# Altium schematic sheet power_cpu.SchDoc
size A3
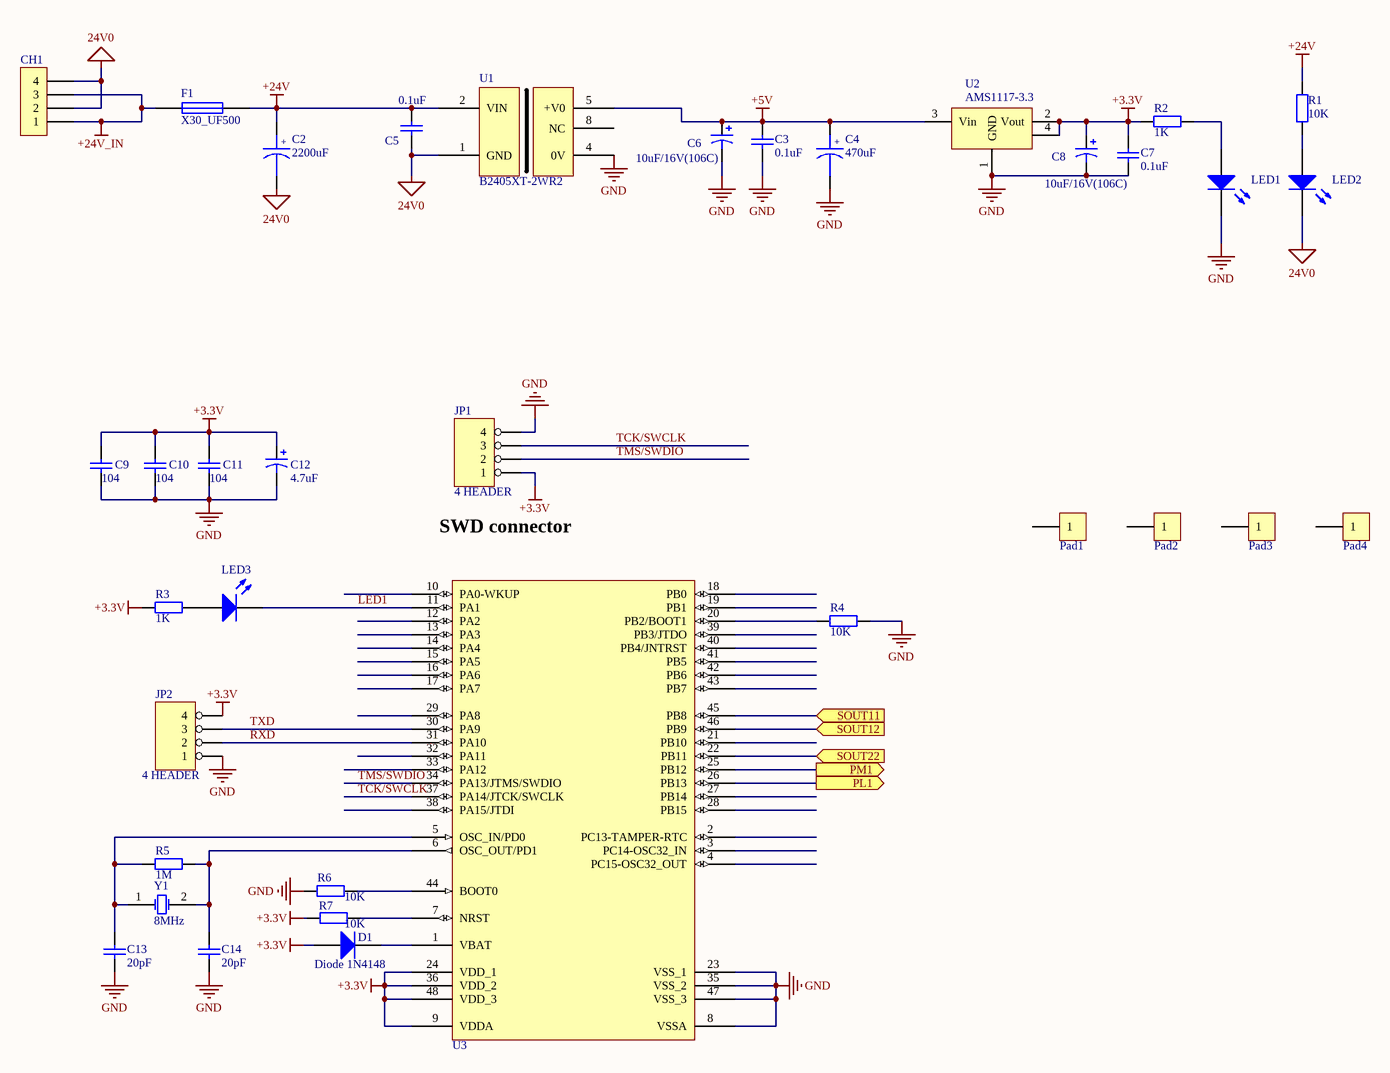
[diagram p0: power_cpu.SchDoc]

## Parts
C2  C_2200uF  [C7.8*17]  (value not drawn)
C3  value 0.1uF  [0805]  (hidden comment: Cap)
C4  C_2200uF  [C5*10]  (value not drawn)
C5  value 0.1uF  [0805]  (hidden comment: Cap)
C6  value 10uF/16V(106C)  [CAP A-3216]  (hidden comment: Cap Pol3)
C7  value 0.1uF  [0805]  (hidden comment: Cap)
C8  value 10uF/16V(106C)  [CAP A-3216]  (hidden comment: Cap Pol3)
C9  value 104  [0805]  (hidden comment: Cap)
C10  value 104  [0805]  (hidden comment: Cap)
C11  value 104  [0805]  (hidden comment: Cap)
C12  value 4.7uF  [3225[1210]]  (hidden comment: Cap Pol1)
C13  value 20pF  [0805]  (hidden comment: Cap)
C14  value 20pF  [0805]  (hidden comment: Cap)
CH1  HEADER1X4  [CH3.96-4PIN]  (value not drawn)
D1  Diode 1N4148  [LL34]
F1  X30_UF500  [X30UF600]
JP1  4 HEADER  [CON4_1.5]
JP2  4 HEADER  [HDR1X4]
LED1  (no value)  [LED-0805]
LED2  (no value)  [LED-0805]
LED3  (no value)  [LED-0805]
Pad1  Pad  [pad35]  (value not drawn)
Pad2  Pad  [pad35]  (value not drawn)
Pad3  Pad  [pad35]  (value not drawn)
Pad4  Pad  [pad35]  (value not drawn)
R1  value 10K  [0805]  (hidden comment: Res2)
R2  value 1K  [0805]  (hidden comment: Res2)
R3  value 1K  [0805]  (hidden comment: Res2)
R4  value 10K  [0805]  (hidden comment: Res2)
R5  value 1M  [0805]  (hidden comment: Res2)
R6  value 10K  [0805]  (hidden comment: Res2)
R7  value 10K  [0805]  (hidden comment: Res2)
U1  B2405XT-2WR2  [B2405XT-2WR2]
U2  AMS1117-3.3  [SOT223]
U3  STM32F103C8T6  [LQFP48]  (value not drawn)
Y1  8MHz  [XTAL_US]

## Ports
PL1 (out), PM1 (out), SOUT11 (in), SOUT12 (in), SOUT22 (in)

## Nets
24V0: C2.2 C5.1 CH1.2 CH1.4 LED2.2(K) U1.1(GND)
+3.3V: C7.2 C8.1 C9.2 C10.2 C11.2 C12.1 D1.1(A) JP1.1 JP2.4 R2.2 R3.2 R7.1 U2.2(Vout) U2.4 U3.9(VDDA) U3.24(VDD_1) U3.36(VDD_2) U3.48(VDD_3)
+5V: C3.2 C4.1 C6.1 U1.5(+V0) U2.3(Vin)
+24V: C2.1 C5.2 F1.2 R1.2 U1.2(VIN)
+24V_IN: CH1.1 CH1.3 F1.1
GND: C3.1 C4.2 C6.2 C7.1 C8.2 C9.1 C10.1 C11.1 C12.2 C13.1 C14.1 JP1.4 JP2.1 LED1.2(K) R4.2 R6.1 U1.4(0V) U2.1(GND) U3.8(VSSA) U3.23(VSS_1) U3.35(VSS_2) U3.47(VSS_3)
LED1: LED3.2(K) U3.11(PA1)
PL1: U3.26(PB13) ; port PL1
PM1: U3.25(PB12) ; port PM1
RXD: JP2.2 U3.31(PA10)
SOUT11: U3.45(PB8) ; port SOUT11
SOUT12: U3.46(PB9) ; port SOUT12
SOUT22: U3.22(PB11) ; port SOUT22
TCK/SWCLK: JP1.3 U3.37(PA14/JTCK/SWCLK)
TMS/SWDIO: JP1.2 U3.34(PA13/JTMS/SWDIO)
TXD: JP2.3 U3.30(PA9)
NetC13_2: C13.2 R5.1 U3.5(OSC_IN/PD0) Y1.1(OSC1)
NetC14_2: C14.2 R5.2 U3.6(OSC_OUT/PD1) Y1.2(OSC2)
NetD1_2: D1.2(K) U3.1(VBAT)
NetLED1_1: LED1.1(A) R2.1
NetLED2_1: LED2.1(A) R1.1
NetLED3_1: LED3.1(A) R3.1
NetR4_1: R4.1 U3.20(PB2/BOOT1)
NetR6_2: R6.2 U3.44(BOOT0)
NetR7_2: R7.2 U3.7(NRST)

Not connected (* = marked no-connect by the designer): Pad1 1; Pad2 1; Pad3 1; Pad4 1; U1 8(NC); U3 2(PC13-TAMPER-RTC) 3(PC14-OSC32_IN) 4(PC15-OSC32_OUT) 10(PA0-WKUP) 12(PA2) 13(PA3) 14(PA4) 15(PA5) 16(PA6) 17(PA7) 18(PB0) 19(PB1) 21(PB10) 27(PB14) 28(PB15) 29(PA8) 32(PA11) 33(PA12) 38(PA15/JTDI) 39(PB3/JTDO) 40(PB4/JNTRST) 41(PB5) 42(PB6) 43(PB7)

## Notes on the sheet
- SWD connector
- (in symbol C_2200uF) +; 2200uF; 470uF

## Library data of the parts
C3 C5 C7 C9-C11 C13 C14 = Cap: Capacitor; Published: 8-Jun-2000; LatestRevisionDate: 17-Jul-2002; LatestRevisionNote: Re-released for DXP Platform.; Publisher: Altium Limited
  C3 C5 C7 C9-C11: PackageReference: RAD-0.3
C6 C8 = Cap Pol3: Polarized Capacitor (Surface Mount); Published: 8-Jun-2000; LatestRevisionDate: 17-Jul-2002; LatestRevisionNote: Re-released for DXP Platform.; PackageReference: C0805; Publisher: Altium Limited
C12 = Cap Pol1: Polarized Capacitor (Radial); Published: 8-Jun-2000; LatestRevisionDate: 17-Jul-2002; LatestRevisionNote: Re-released for DXP Platform.; PackageReference: RB7.6-15; Publisher: Altium Limited
D1 = Diode 1N4148: High Conductance Fast Diode; Published: 8-Jun-2000; LatestRevisionDate: 17-Jul-2002; LatestRevisionNote: Re-released for DXP Platform.; DatasheetDocument: 1997; PackageReference: DO-35; Publisher: Altium Limited; Code_JEDEC: DO-204-AH; ComponentLink1Description: Manufacturer Link; ComponentLink1URL: http://www.fairchildsemi.com/; ComponentLink2Description: Datasheet; ComponentLink2URL: http://www.fairchildsemi.com/ds/1N%2F1N4148.pdf
F1 = Fuse 1: Fuse; Published: 8-Jun-2000; LatestRevisionDate: 17-Jul-2002; LatestRevisionNote: Re-released for DXP Platform.; PackageReference: PIN-W2/E2.8; Publisher: Altium Limited
JP1 JP2 = 4 HEADER: 4 Pin Header
LED1-LED3 = LED2: Typical RED, GREEN, YELLOW, AMBER GaAs LED; Published: 8-Jun-2000; LatestRevisionDate: 17-Jul-2002; LatestRevisionNote: Re-released for DXP Platform.; PackageDocument: Feb-2002; PackageReference: 3.2X1.6X1.1; Publisher: Altium Limited
R1-R7 = Res2: Resistor; Published: 8-Jun-2000; LatestRevisionDate: 17-Jul-2002; LatestRevisionNote: Re-released for DXP Platform.; Publisher: Altium Limited
  R1-R3: PackageReference: AXIAL-0.4
U2 = AMS1117-5
Y1 = XTAL: Crystal Oscillator; Published: 8-Jun-2000; LatestRevisionDate: 17-Jul-2002; LatestRevisionNote: Re-released for DXP Platform.; Publisher: Altium Limited